# Altium schematic sheet _io.SchDoc
size Tabloid
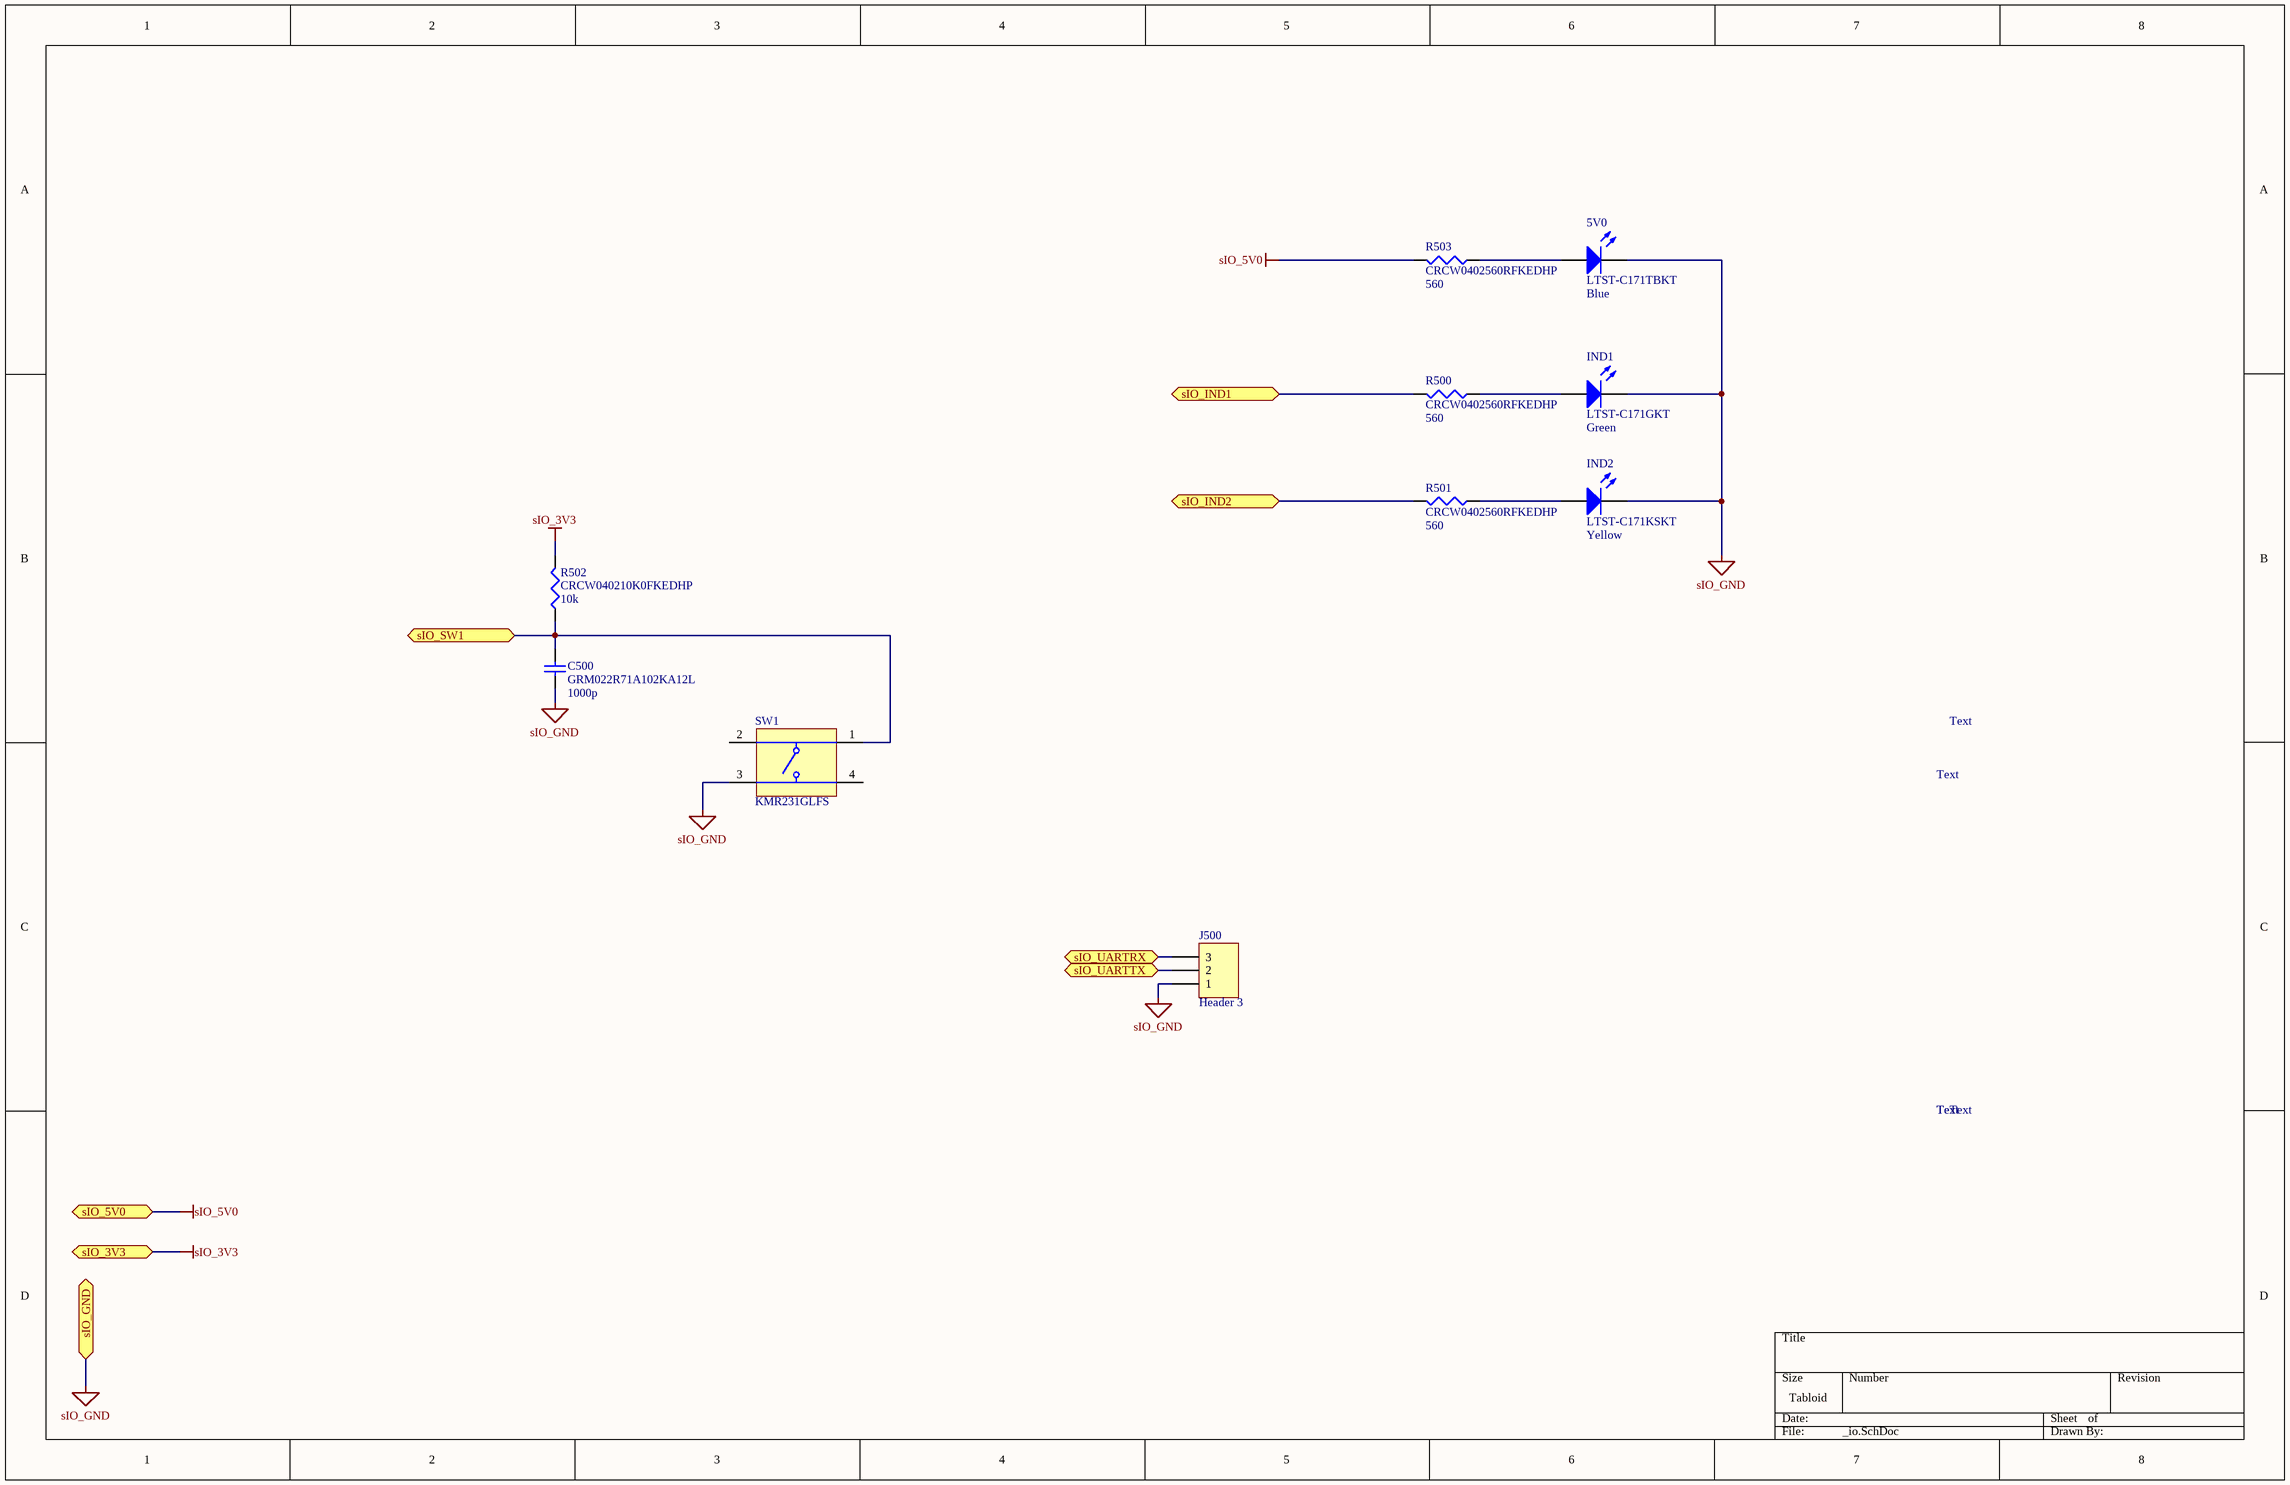
[diagram p0: _io.SchDoc]

## Parts
5V0  LTST-C171TBKT  Color: Blue  [0805]
C500  GRM022R71A102KA12L  value 1000p  [0402]
IND1  LTST-C171GKT  Color: Green  [0805]
IND2  LTST-C171KSKT  Color: Yellow  [0805]
J500  Header 3  [HDR1X3]
R500  CRCW0402560RFKEDHP  value 560  [0402]
R501  CRCW0402560RFKEDHP  value 560  [0402]
R502  CRCW040210K0FKEDHP  value 10k  [0402]
R503  CRCW0402560RFKEDHP  value 560  [0402]
SW1  KMR231GLFS  [CKCP-KMR231GLFS]

## Ports
sIO_3V3, sIO_5V0, sIO_GND, sIO_IND1, sIO_IND2, sIO_SW1, sIO_UARTRX, sIO_UARTTX

## Nets
sIO_3V3: R502.2 ; port sIO_3V3
sIO_5V0: R503.2 ; port sIO_5V0
sIO_GND: 5V0.2(K) C500.1 IND1.2(K) IND2.2(K) J500.1 SW1.3 ; port sIO_GND
sIO_IND1: R500.2 ; port sIO_IND1
sIO_IND2: R501.2 ; port sIO_IND2
sIO_SW1: C500.2 R502.1 SW1.1 ; port sIO_SW1
sIO_UARTRX: J500.3 ; port sIO_UARTRX
sIO_UARTTX: J500.2 ; port sIO_UARTTX
Net5V0_1: 5V0.1(A) R503.1
NetIND1_1: IND1.1(A) R500.1
NetIND2_1: IND2.1(A) R501.1

Not connected (* = marked no-connect by the designer): SW1 2 4

## Notes on the sheet
- Text

## Library data of the parts
5V0 IND1 = LTST-C171GKT: LED
C500 = GRM022R71AxxxKdddd: -55-125C, 1005, 10V, X7R, ±10%
IND2 = LTST-C171KSKT: LED
J500 = Header 3: Header, 3-Pin; LatestRevisionDate: 17-Jul-2002; LatestRevisionNote: Re-released for DXP Platform.; Publisher: Altium Limited
R500-R503 = CRCW0402xxxxFKED: 0.125W, -55-155C, 1005, 50V, ±1%
SW1 = CMP-2000-06516-1: Switch Tactile, SPST, 50 mA, 32 V, -40 to 85 degC, 4-Pin SMD, RoHS, Tape and Reel; Manufacturer: C&K Components; Mechanical Life: 150000Cycles; Switch Configuration: N.O.; Actuator Style: Button; Ground Terminal: Yes; Maximum DC Voltage Rating: 32V; Minimum Insulation Resistance: >=1000MOhm; Dielectric Strength: >=250Vrms; Operating Force: 3N; Illumination Type: N/R; Body Orientation: Straight; Contact Rating @ Voltage: 1A; Actuator Length: 0.5mm; Operating Temperature: -40to85C; Electrical Life: N/A; Housing Material: N/A; ECCN: EAR99; Pole Throw Configuration: SPST; Contact Plating: Silver; Dimension: 2.8x4.6x1.9mm; Type: Micro-Miniature; Product Weight: N/A; Package Description: 4-Pin Surface Mount Device, Body 4.6 x 2.8 mm; Actuator Color: N/A; HTS: 8536501199; Mounting Technology: SurfaceMount; Mounting: SurfaceMount,GullWing; Seal Location: N/A; Base Material: N/A; Family: KMR2; Part No: KMR231GLFS; Datasheet Version: 06/2016; Contact Material: Silver; Package Reference: KMR231GLFS; Manufacturer URL: http://www.ckswitches.com/; Maximum AC Voltage Rating: N/A; Datasheet URL: http://www.ck-components.com/media/1479/kmr2.pdf; RoHS: Yes; Seal Description: N/A; Packaging: TapeandReel; Supplier: C&KComponents